# EAGLE design Segment16Keyboard (EAGLE 7.5.0)
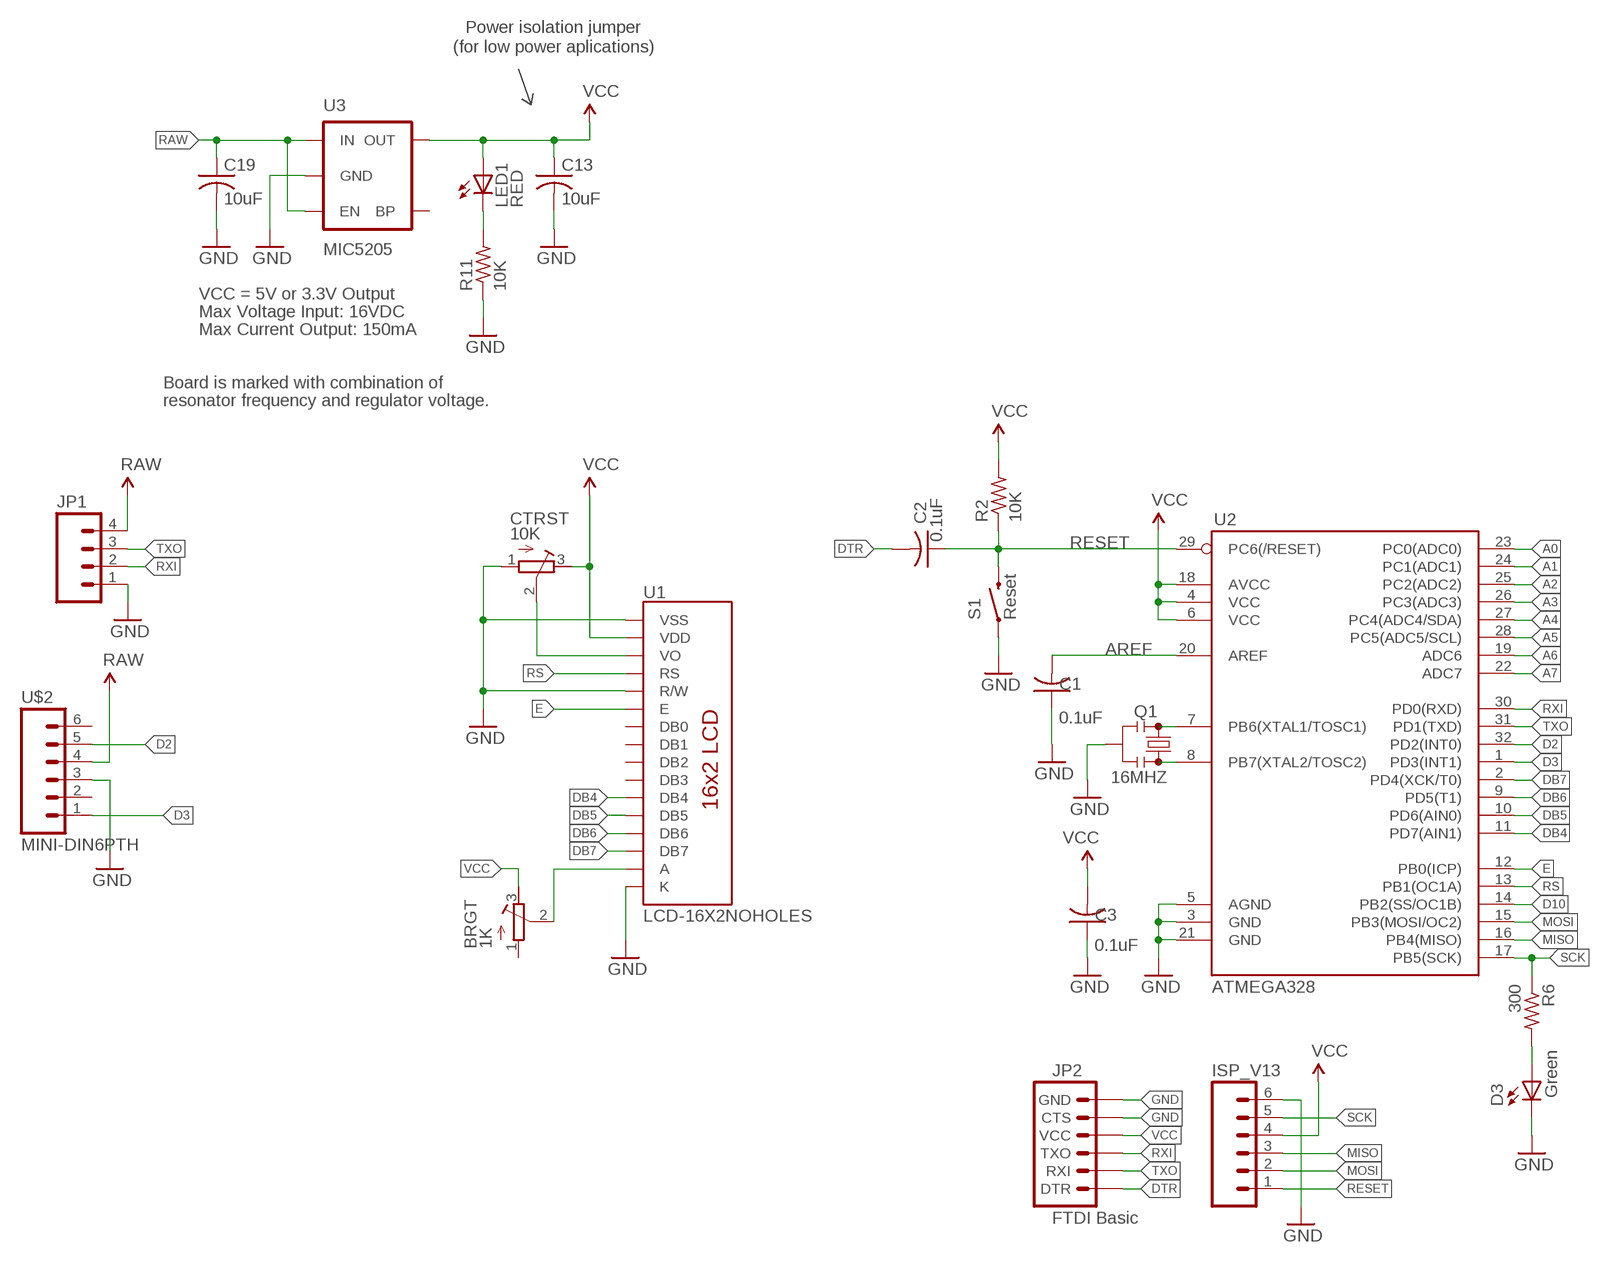
[diagram p0: schematic, sheet 1]

## Parts
BRGT  1K  R-TRIMM3296W  [RTRIM3296W]
C1  0.1uF  C-USC0805  [C0805]
C2  0.1uF  C-USC0805  [C0805]
C3  0.1uF  C-USC0805  [C0805]
C13  10uF  C-USC0805  [C0805]
C19  10uF  C-USC0805  [C0805]
CTRST  10K  R-TRIMM3296W  [RTRIM3296W]
D3  Green  LEDCHIPLED_0805  [CHIPLED_0805]
ISP_V13  M06SIP  [1X06]
JP1  M041X04_NO_SILK  [1X04_NO_SILK]
JP2  FTDI Basic  ARDUINO_SERIAL_PROGRAMPTH  [1X06]
LED1  RED  LED  [0603-LED-ALT1]
Q1  16MHZ  RESONATOR16MHZ  [RESONATOR-SMD]
R2  10K  R-US_M0805  [M0805]
R6  300  R-US_M0805  [M0805]
R11  10K  R-US_R0805  [R0805]
S1  Reset  SWITCH-MOMENTARY-2SMD-ALT01  [TACTILE-SWITCH-SMD-ALT01]
U1  LCD-16X2NOHOLES  [LCD-16X2_NOHOLES]
U2  ATMEGA328  ATMEGA168  [TQFP32-08]
U3  MIC5205  V_REG_LDOSMD  [SOT23-5]
U$2  MINI-DIN6PTH  [MINI-DIN6]

## Nets
A: BRGT.2(S) U1.15(A)
A0: U2.23(PC0(ADC0))
A1: U2.24(PC1(ADC1))
A2: U2.25(PC2(ADC2))
A3: U2.26(PC3(ADC3))
A4: U2.27(PC4(ADC4/SDA))
A5: U2.28(PC5(ADC5/SCL))
A6: U2.19(ADC6)
A7: U2.22(ADC7)
AREF: C1.2 U2.20(AREF)
D2: U2.32(PD2(INT0)) U$2.5
D3: U2.1(PD3(INT1)) U$2.1
D10: U2.14(PB2(SS/OC1B))
DB4: U1.11(DB4) U2.11(PD7(AIN1))
DB5: U1.12(DB5) U2.10(PD6(AIN0))
DB6: U1.13(DB6) U2.9(PD5(T1))
DB7: U1.14(DB7) U2.2(PD4(XCK/T0))
DTR: C2.2 JP2.1(DTR)
E: U1.6(E) U2.12(PB0(ICP))
GND: C1.1 C3.1 C13.2 C19.2 CTRST.1(A) D3.C ISP_V13.6 JP1.1 JP2.5(CTS) JP2.6(GND) Q1.2 R11.1 S1.1 S1.2 U1.1(VSS) U1.5(R/W) U1.16(K) U2.3(GND) U2.5(AGND) U2.21(GND) U3.2(GND) U$2.3
MISO: ISP_V13.3 U2.16(PB4(MISO))
MOSI: ISP_V13.2 U2.15(PB3(MOSI/OC2))
N$12: D3.A R6.2
N$13: Q1.3 U2.8(PB7(XTAL2/TOSC2))
N$15: Q1.1 U2.7(PB6(XTAL1/TOSC1))
N$20: LED1.C R11.2
RAW: C19.1 JP1.4 U3.1(IN) U3.3(EN) U$2.4
RESET: C2.1 ISP_V13.1 R2.1 S1.3 S1.4 U2.29(PC6(/RESET))
RS: U1.4(RS) U2.13(PB1(OC1A))
RXI: JP1.2 JP2.3(TXO) U2.30(PD0(RXD))
SCK: ISP_V13.5 R6.1 U2.17(PB5(SCK))
TXO: JP1.3 JP2.2(RXI) U2.31(PD1(TXD))
VCC [raw]: BRGT.3(E) C3.2 C13.1 CTRST.3(E) ISP_V13.4 JP2.4(VCC) LED1.A R2.2 U1.2(VDD) U2.4(VCC) U2.6(VCC) U2.18(AVCC) U3.5(OUT)
VO: CTRST.2(S) U1.3(VO)
Unconnected: BRGT.1(A) U1.7(DB0) U1.8(DB1) U1.9(DB2) U1.10(DB3) U3.4(BP) U$2.2 U$2.6

## Notes on the sheet
- Power isolation jumper
- (for low power aplications)
- VCC = 5V or 3.3V Output
- Max Voltage Input: 16VDC
- Max Current Output: 150mA
- Board is marked with combination of
- resonator frequency and regulator voltage.

## Library data of the parts
BRGT CTRST = resistor:R-TRIMM: Trimm resistor
C1-C3 = adafruit:C-US: CAPACITOR, American symbol
C13 C19 = resistor:C-US: CAPACITOR, American symbol
D3 = adafruit:LED: LED OSRAM: - CHIPLED LG R971, LG N971, LY N971, LG Q971, LY Q971, LO R971, LY R971 LH N974, LH R974 LS Q976, LO Q976, LY Q976 LO Q996 - Hyper CHIPLED LW Q18S LB Q993, LB Q99A, LB R99A - SideLED LS A670, LO A670, LY A670, LG A670, LP A670 LB A673, LV A673, LT A673, LW A673 LH A674 LY A675 LS A676, LA A676, LO A676, LY A676, LW A676 LS A679, LY A679, LG A679 - Hyper Micro SIDELED® LS Y876, LA Y876, LO Y876, LY Y876 LT Y87S - SmartLED LW L88C, LW L88S LB L89C, LB L89S, LG L890 LS L89K, LO L89K, LY L89K LS L896, LA L896, LO L896, LY L896 - TOPLED LS T670, LO T670, LY T670, LG T670, LP T670 LSG T670, LSP T670, LSY T670, LOP T670, LYG T670 LG T671, LOG T671, LSG T671 LB T673, LV T673, LT T673, LW T673 LH T674 LS T676, LA T676, LO T676, LY T676, LB T676, LH T676, LSB T676, LW T676 LB T67C, LV T67C, LT T67C, LS T67K, LO T67K, LY T67K, LW E67C LS E67B, LA E67B, LO E67B, LY E67B, LB E67C, LV E67C, LT E67C LW T67C LS T679, LY T679, LG T679 LS T770, LO T770, LY T770, LG T770, LP T770 LB T773, LV T773, LT T773, LW T773 LH T774 LS E675, LA E675, LY E675, LS T675 LS T776, LA T776, LO T776, LY T776, LB T776 LHGB T686 LT T68C, LB T68C - Hyper Mini TOPLED® LB M676 - Mini TOPLED Santana® LG M470 LS M47K, LO M47K, LY M47K Source: http://www.osram.convergy.de/
ISP_V13 = SparkFun-Connectors:M06: Header 6 Standard 6-pin 0.1" header. Use with straight break away headers (SKU : PRT-00116), right angle break away headers (PRT-00553), swiss pins (PRT-00743), machine pins (PRT-00117), and female headers (PRT-00115). Molex polarized connector foot print use with SKU : PRT-08094 with associated crimp pins and housings. NOTES ON THE VARIANTS LOCK and LOCK_LONGPADS... This footprint was designed to help hold the alignment of a through-hole component (i.e. 6-pin header) while soldering it into place. You may notice that each hole has been shifted either up or down by 0.005 of an inch from it's more standard position (which is a perfectly straight line). This slight alteration caused the pins (the squares in the middle) to touch the edges of the holes. Because they are alternating, it causes a "brace" to hold the component in place. 0.005 has proven to be the perfect amount of "off-center" position when using our standard breakaway headers. Although looks a little odd when you look at the bare footprint, once you have a header in there, the alteration is very hard to notice. Also, if you push a header all the way into place, it is covered up entirely on the bottom side. This idea of altering the position of holes to aid alignment will be further integrated into the Sparkfun Library for other footprints. It can help hold any component with 3 or more connection pins.
JP1 = SparkFun-Connectors:M04: Header 4 Standard 4-pin 0.1" header. Use with straight break away headers (SKU : PRT-00116), right angle break away headers (PRT-00553), swiss pins (PRT-00743), machine pins (PRT-00117), and female headers (PRT-00115). Molex polarized connector foot print use with SKU : PRT-08231 with associated crimp pins and housings. 1MM SMD Version SKU: PRT-10208
JP2 = SparkFun:ARDUINO_SERIAL_PROGRAM
LED1 = Testing:LED: LEDs Standard schematic elements and footprints for 5mm, 3mm, 1206, and 0603 sized LEDs. 5mm - Spark Fun Electronics SKU : COM-00529 (and others)
Q1 = SparkFun-FreqCtrl:RESONATOR: Resonator Small SMD resonator. Used, eg, on the Arduino Pro/ Pro Mini boards. 8MHz- XTAL-08895 16MHz- XTAL-08900; PROD_ID: XTAL-08900
R2 R6 R11 = adafruit:R-US_: RESISTOR, American symbol
S1 = Testing:SWITCH-MOMENTARY-2: Various NO switches- pushbuttons, reed, etc
U1 = SparkFun-Displays:LCD-16X2: Standard text-only 16x2 parallel input LCD
U2 = SparkFun:ATMEGA168
U3 = SparkFun:V_REG_LDO: Voltage Regulator LDO Standard 150mA LDO voltage regulator in SOT-23 layout. Micrel part MIC5205. BP (by-pass) pin is used to lower output noise with 470pF cap.
U$2 = SparkFun-Connectors:MINI-DIN6: mini DIN 6 Connector Commonly found on the back of a computer for PS2 keyboard and mice. Schematic and footprint are proven. Spark Fun Electronics SKU : PRT-08509

## Net classes
0 default: width 0.254 mm, drill 0.381 mm, clearance 0.254 mm
1 vcc: width 0.508 mm, drill 0.508 mm, clearance 0.254 mm
2 raw: width 0.508 mm, drill 0.508 mm, clearance 0.254 mm

## Board
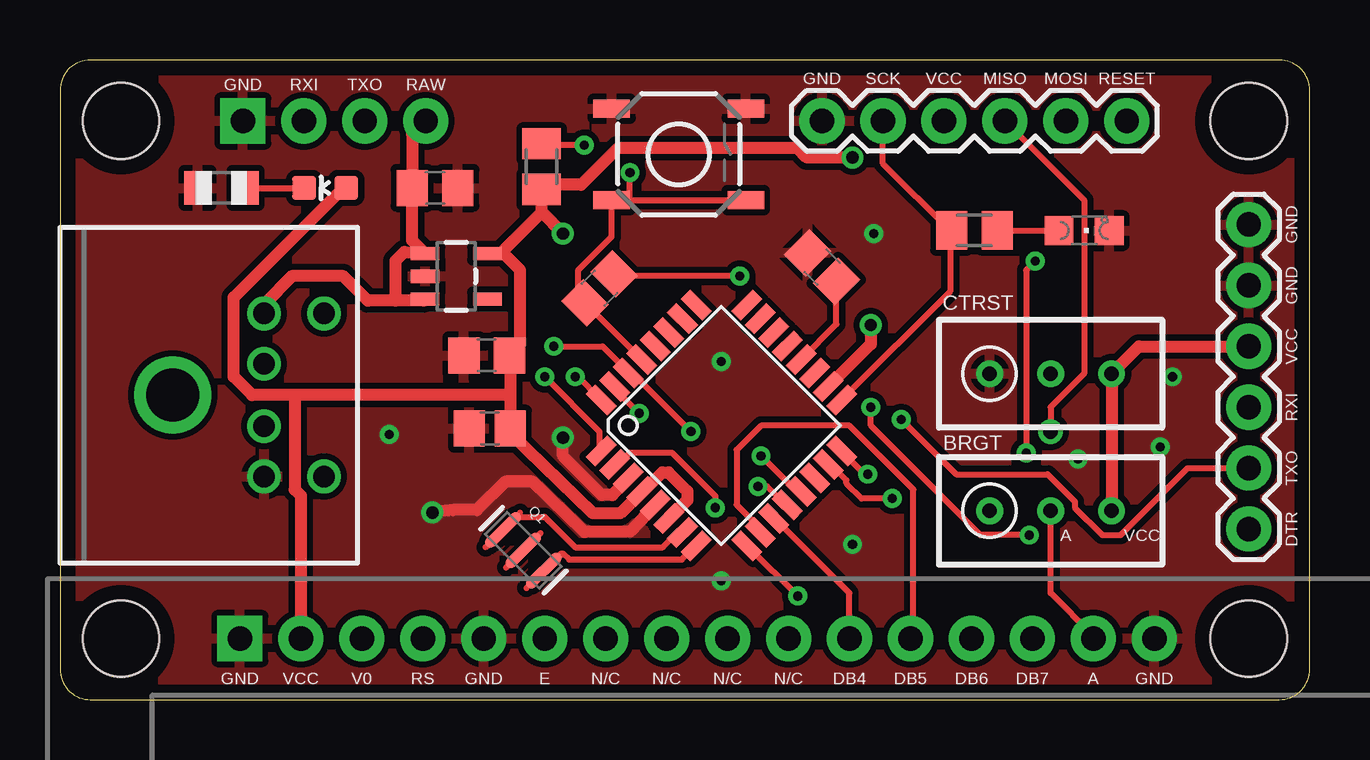
[diagram p1: board, top side]
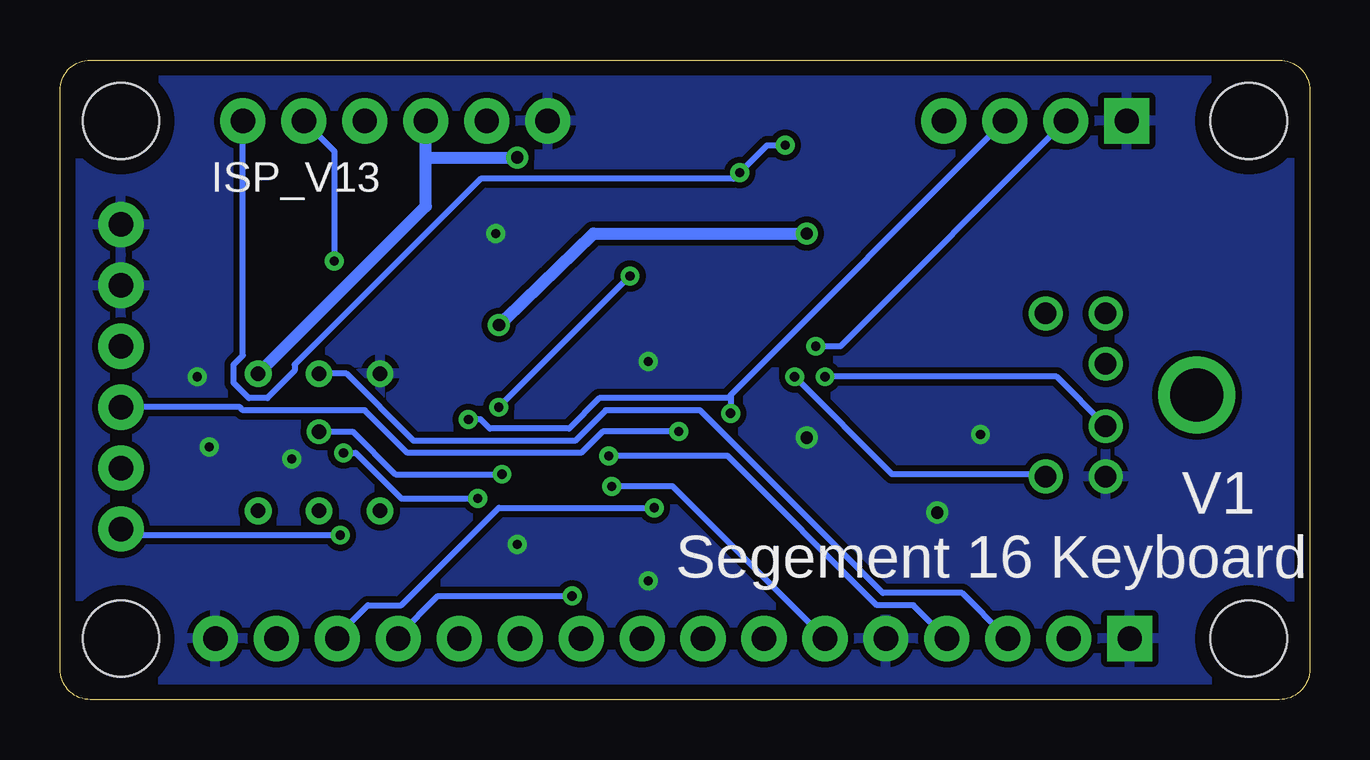
[diagram p2: board, bottom side, seen from below]

Size 52.07 x 26.67 mm. Coordinates in mm from the lower left corner, seen from the top.
Outline: 0,25.4 0,1.27 arc90 1.27,0 50.8,0 arc90 52.07,1.27 52.07,25.4 arc90 50.8,26.67 1.27,26.67 arc90 0,25.4
Copper layers (1*16): Top 0.035mm / dielectric 1.5mm / Bottom 0.035mm
Design rules "default *": minimum track width 10mil, minimum drill 15mil, track to track 8mil, track to pad 8mil, pad to pad 8mil, via to via 8mil, smd to smd 8mil, copper to edge 25mil, drill to drill 8mil, minimum pad ring 10mil, minimum via ring 8mil, stop-mask expansion 4mil, vias tented up to drill 15mil, thermal gap 10mil
Holes 3.17 mm at 2.54,2.54 2.54,24.13 49.53,24.13 49.53,2.54

### Footprints (pad centres in the part's own frame; a part is rotated, then mirrored left to right if it is on the bottom)
RTRIM3296W = drill 0.61: 1 0,-2.54; 2 0,0; 3 0,2.54
C0805 = smd 1.3 x 1.5: 1 -0.85,0; 2 0.85,0
C0805' = smd 1.3 x 1.5: 1 -0.95,0; 2 0.95,0
CHIPLED_0805 = smd 1.2 x 1.2: A 0,-1.05; C 0,1.05
1X06 = drill 1.016 pad 1.88: 1 0,0; 2 2.54,0; 3 5.08,0; 4 7.62,0; 5 10.16,0; 6 12.7,0
1X04_NO_SILK = drill 1.016 pad 1.88 square: 1 0,0 | drill 1.016 pad 1.88: 2 2.54,0; 3 5.08,0; 4 7.62,0
0603-LED-ALT1 = smd 1 x 1: A 0,-0.877; C 0,0.877
RESONATOR-SMD = smd 0.45 x 1.905: 1 -1.2,0; 2 0,0; 3 1.2,0
M0805 = smd 1.3 x 1.6: 1 -0.95,0; 2 0.95,0
R0805 = smd 1.1 x 1.4: 1 -1,0; 2 1,0
TACTILE-SWITCH-SMD-ALT01 = smd 1.524 x 0.762: 1 -2.794,1.905; 2 2.794,1.905; 3 -2.794,-1.905; 4 2.794,-1.905
LCD-16X2_NOHOLES = drill 1.016 pad 1.88 square: 1 -32,15.5 | drill 1.016 pad 1.88: 2 -29.46,15.5; 3 -26.92,15.5; 4 -24.38,15.5; 5 -21.84,15.5; 6 -19.3,15.5; 7 -16.76,15.5; 8 -14.22,15.5; 9 -11.68,15.5; 10 -9.14,15.5; 11 -6.6,15.5; 12 -4.06,15.5; 13 -1.52,15.5; 14 1.02,15.5; 15 3.56,15.5; 16 6.1,15.5
TQFP32-08 = smd 1.27 x 0.559: 1 -4.293,2.8; 2 -4.293,2; 3 -4.293,1.2; 4 -4.293,0.4; 5 -4.293,-0.4; 6 -4.293,-1.2; 7 -4.293,-2; 8 -4.293,-2.8; 17 4.293,-2.8; 18 4.293,-2; 19 4.293,-1.2; 20 4.293,-0.4; 21 4.293,0.4; 22 4.293,1.2; 23 4.293,2; 24 4.293,2.8 | smd 0.559 x 1.27: 9 -2.8,-4.293; 10 -2,-4.293; 11 -1.2,-4.293; 12 -0.4,-4.293; 13 0.4,-4.293; 14 1.2,-4.293; 15 2,-4.293; 16 2.8,-4.293; 25 2.8,4.293; 26 2,4.293; 27 1.2,4.293; 28 0.4,4.293; 29 -0.4,4.293; 30 -1.2,4.293; 31 -2,4.293; 32 -2.8,4.293
SOT23-5 = smd 0.55 x 1.2: 1 -0.95,-1.3; 2 0,-1.3; 3 0.95,-1.3; 4 0.95,1.3; 5 -0.95,1.3
MINI-DIN6 = drill 0.9: 1 -1.3,-8.5; 2 1.3,-8.5; 3 -3.4,-8.5; 4 3.4,-8.5; 5 -3.4,-11; 6 3.4,-11 | drill 2.2: P$1 0,-4.7

### Placement (x,y rotation side)
BRGT  41.27,7.87 270 top
C1  31.75,18.03 315 top
C2  22.48,17.14 45 top
C3  17.91,11.3 0 top
C13  10uF  [C0805']  17.78,14.35 180 top
C19  10uF  [C0805']  15.62,21.34 0 top
CTRST  41.27,13.59 270 top
D3  42.67,19.56 270 top
ISP_V13  44.45,24.13 180 top
JP1  7.62,24.13 0 top
JP2  49.53,7.11 90 top
LED1  11.05,21.34 90 top
Q1  19.3,6.22 315 top
R2  20.07,22.23 270 top
R6  38.1,19.56 0 top
R11  6.73,21.34 0 top
S1  25.78,22.73 0 top
U1  39.5,-12.95 0 top
U2  27.56,11.43 45 top
U3  16.51,17.65 270 top
U$2  0,12.7 90 top

### Tracks (layer width: path | path; a pad name or v marks a point on that pad's centre or on a via)
A
  Top 0.254: BRGT.2 41.27,4.45 43.05,2.67 U1.15
AREF
  Top 0.254: U2.20 32.35,15.66 C1.2
D2  (via drill 0.38)
  Top 0.254: v21.46,13.46 21.59,13.46 22.48,12.57 U2.32
  Bottom 0.254: v21.46,13.46 17.4,9.4 11.05,9.4 U$2.5
D3  (via drill 0.38)
  Top 0.254: v20.19,13.46 22.48,11.18 22.48,10.41 U2.1
  Bottom 0.254: v20.19,13.46 10.54,13.46 8.51,11.43 U$2.1
DB4
  Top 0.254: U2.11 29.84,7.49 32.89,4.45 32.89,2.67 U1.11
DB5
  Top 0.254: U2.10 29.08,6.99 29.08,7.24 28.19,8.13 28.19,10.41 29.21,11.43 32.89,11.43 35.56,8.76 35.56,2.67 U1.12
DB6  (via drill 0.38)
  Top 0.254: v30.73,4.32 28.7,6.35 U2.9
  Bottom 0.254: v30.73,4.32 36.32,4.32 37.97,2.67 U1.13
DB7  (via drill 0.38)
  Top 0.254: U2.2 23.11,9.91 23.37,9.91 23.75,10.29 25.5,10.29 27.3,8.48 v27.3,8
  Bottom 0.254: v27.3,8 33.78,8 37.85,3.94 39.24,3.94 40.51,2.67 U1.14
DTR  (via drill 0.38)
  Top 0.254: v28.32,17.65 23.11,17.65 C2.2 | v33.78,12.19 33.78,11.43 38.35,6.86 v40.39,6.86
  Bottom 0.254: v33.78,12.19 v28.32,17.65 | v40.39,6.86 49.28,6.86 JP2.1
E  (via drill 0.38)
  Top 0.254: v29.08,8.89 29.46,8.89 30.23,8.13 U2.12
  Bottom 0.254: v29.08,8.89 26.54,8.89 20.32,2.67 U1.6
GND  (via drill 0.38, 0.51)
  Top 0.254: 23.75,9.27 U2.3
  Top 0.508: v20.95,10.92 20.95,10.16 22.58,8.53 23.01,8.53 23.75,9.27 | U2.5 23.76,7.01 21.84,6.99 19.68,9.09 18.57,9.09 17.37,7.9 16.38,7.9 v15.52,7.8
  other vias: 45.85,10.54 46.35,13.46 33.91,19.43 27.56,14.1 27.56,4.95 33.02,6.48 13.72,11.05 42.42,10.03
  pour Top: -1.27,27.94 53.34,27.94 53.34,-1.27 -1.27,-1.27
  pour Bottom: -1.27,27.94 53.34,27.94 53.34,-1.27 -1.27,-1.27
MISO  (via drill 0.38, 0.61)
  Top 0.254: v33.66,9.4 33.53,9.4 32.64,10.29 U2.16 | v41.27,11.18 41.27,12.19 42.67,13.59 42.67,20.83 ISP_V13.3
  Bottom 0.254: v33.66,9.4 38.1,9.4 39.88,11.18 v41.27,11.18
MOSI  (via drill 0.38)
  Top 0.254: v34.67,8.38 33.4,8.38 32.77,9.02 32.77,9.14 32.13,9.78 U2.15 | v40.26,10.29 40.26,17.91 v40.64,18.29
  Bottom 0.254: v34.67,8.38 37.85,8.38 39.75,10.29 v40.26,10.29 | v40.64,18.29 40.64,22.86 ISP_V13.2
N$12
  Top 0.254: R6.2 D3.A
N$13
  Top 0.254: U2.8 26.42,6.35 25.91,5.84 21.21,5.84 20.95,6.1 Q1.3
N$15
  Top 0.254: U2.7 25.91,6.86 25.65,6.86 25.12,6.35 21.46,6.35 20.19,7.62 19.18,7.62 Q1.1
N$20
  Top 0.254: R11.2 LED1.C
RAW
  Top 0.508: JP1.4 14.67,23.56 C19.1 14.67,19.14 U3.1 14.35,18.67 13.97,18.29 13.97,16.64 | U3.3 15.14,16.64 13.97,16.64 | 13.97,16.64 12.83,16.64 11.81,17.65 9.65,17.65 8.5,16.5 U$2.4
RESET  (via drill 0.38)
  Top 0.254: U2.29 C2.1 21.84,16.64 21.59,16.89 21.59,17.91 22.99,19.3 S1.3 23.75,20.83 | 23.75,20.83 S1.4 | v21.84,23.11 20.07,23.11 R2.1 | 23.75,20.83 v23.75,21.97
  Bottom 0.254: v21.84,23.11 22.61,23.11 v23.75,21.97 24,21.72 34.54,21.72 42.29,13.97 42.29,13.72 43.43,12.57 44.2,12.57 44.83,13.21 44.83,13.97 44.45,14.35 ISP_V13.1
RS  (via drill 0.38)
  Top 0.254: v29.21,10.16 30.61,8.76 30.86,8.76 U2.13
  Bottom 0.254: v29.21,10.16 24.26,10.16 18.03,3.94 16.51,3.94 15.24,2.67 U1.4
RXI  (via drill 0.38)
  Top 0.254: v20.57,14.73 22.61,14.73 23.62,13.72 U2.30 23.75,13.72 v26.29,11.18
  Bottom 0.254: v20.57,14.73 19.56,14.73 JP1.2 | JP2.3 44.58,12.19 44.45,12.06 39.37,12.06 37.59,10.29 30.35,10.29 29.46,11.18 v26.29,11.18
SCK
  Top 0.254: 37.08,19.56 37.08,17.02 32.64,12.57 U2.17 | ISP_V13.5 34.29,22.35 37.08,19.56 | 37.08,19.56 R6.1
TXO  (via drill 0.38)
  Top 0.254: v24.13,11.94 23.11,12.95 U2.31 | JP2.2 46.99,9.65 44.2,6.86 43.43,6.86 42.29,8 42.29,8.26 41.15,9.4 37.34,9.4 v35.05,11.68
  Bottom 0.254: 24.13,12.57 24.13,12.7 JP1.3 | 24.13,12.57 v24.13,11.94 | v35.05,11.68 34.54,11.68 34.16,11.3 30.86,11.3 29.59,12.57 24.13,12.57
VCC  (via drill 0.51)
  Top 0.508: 18.76,12.7 18.76,14.32 C13.1 19.18,14.8 19.18,17.91 18.48,18.6 | 18.76,12.7 C3.2 18.76,11.09 22.2,7.77 23.34,7.77 U2.4 24.3,8.68 25.09,9.47 25.35,9.47 26.14,8.69 26.14,8.31 U2.6 | 18.48,18.6 U3.5 | 18.76,12.7 9.78,12.7 | 9.78,12.7 8,12.7 7.24,13.46 7.24,16.76 11.81,21.34 LED1.A | 20.07,20.32 R2.2 20.19,21.46 21.72,21.46 23.24,22.99 30.73,22.99 31.11,22.61 v33.02,22.61 | 20.07,20.32 18.54,18.8 18.48,18.6 | 9.78,12.7 9.78,8.76 10.03,8.51 10.03,2.67 U1.2 | BRGT.3 CTRST.3 44.96,14.73 JP2.4 | 20.07,20.32 v20.95,19.43 | v33.78,15.62 33.78,14.82 U2.18
  Bottom 0.508: 36.83,22.61 36.83,20.57 CTRST.3 | 36.83,22.61 ISP_V13.4 | 36.83,22.61 v33.02,22.61 | v33.78,15.62 33.53,15.88 29.84,19.43 v20.95,19.43
VO
  Bottom 0.254: CTRST.2 40.13,13.59 37.34,10.79 30.61,10.79 29.34,12.06 25.4,12.06 17.78,4.45 14.48,4.45 12.7,2.67 U1.3

### Text on the board
tNames: GND | SCK | VCC | MISO | MOSI | RESET | GND | RXI | TXO | RAW | GND | GND | VCC | RXI | TXO | A | VCC | DTR | GND | VCC | V0 | RS | GND | E | N/C | N/C | N/C | N/C | DB4 | DB5 | DB6 | DB7 | A | GND
bNames: V1 | Segement 16 Keyboard